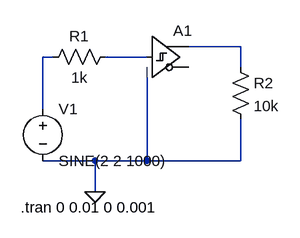
[diagram p0: schematic SmittTrigger.asc]
SmittTrigger.asc, the LTspice schematic file:
Version 4
SHEET 1 880 680
WIRE 384 -64 304 -64
WIRE 96 -48 80 -48
WIRE 240 -48 176 -48
WIRE 384 -32 384 -64
WIRE 80 32 80 -48
WIRE 160 112 80 112
WIRE 240 112 240 -16
WIRE 240 112 160 112
WIRE 384 112 384 48
WIRE 384 112 240 112
WIRE 160 160 160 112
FLAG 160 160 0
SYMBOL voltage 80 16 R0
WINDOW 123 0 0 Left 2
WINDOW 39 0 0 Left 2
SYMATTR InstName V1
SYMATTR Value SINE(2 2 1000)
SYMBOL Digital\\schmitt 240 -112 R0
SYMATTR InstName A1
SYMBOL res 192 -64 R90
WINDOW 0 0 56 VBottom 2
WINDOW 3 32 56 VTop 2
SYMATTR InstName R1
SYMATTR Value 1k
SYMBOL res 368 -48 R0
SYMATTR InstName R2
SYMATTR Value 10k
TEXT 46 184 Left 2 !.tran 0 0.01 0 0.001

The netlist it stands for:
* SmittTrigger.asc
V1 N002 0 SINE(2 2 1000)
A1 N003 0 0 0 0 0 N001 0 SCHMITT
R1 N003 N002 1k
R2 N001 0 10k
.tran 0 0.01 0 0.001
.backanno
.end